# Altium schematic sheet OTHERS.SchDoc
size A4
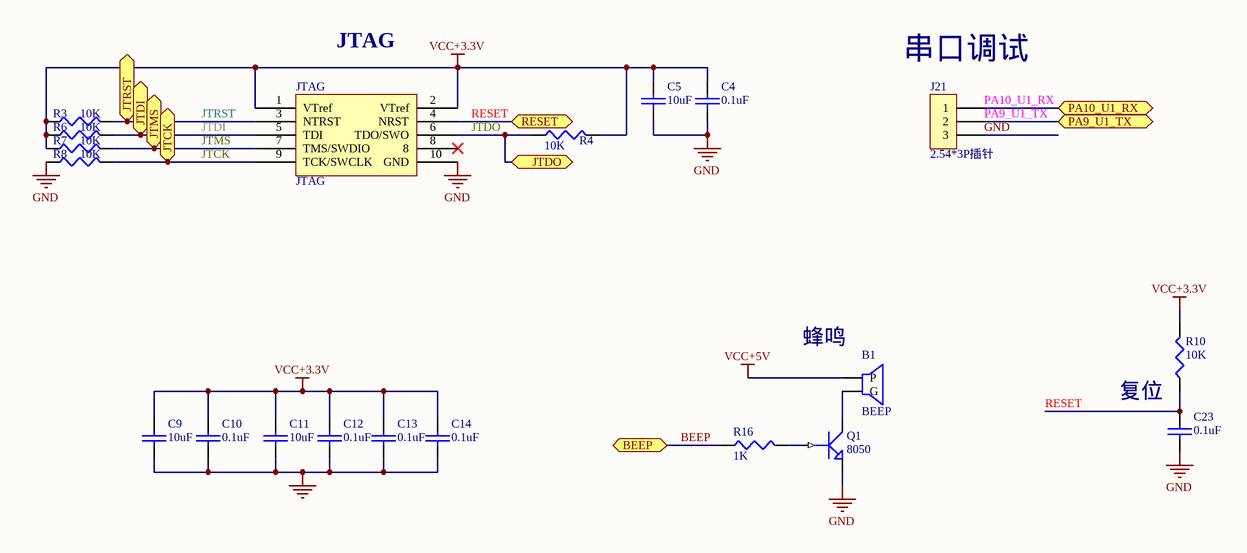
[diagram p0: OTHERS.SchDoc]

## Parts
B1  BEEP  [BEEP-W]
C4  0.1uF  [0603]
C5  10uF  [0805]
C9  10uF  [0805]
C10  0.1uF  [0603]
C11  10uF  [0805]
C12  0.1uF  [0603]
C13  0.1uF  [0603]
C14  0.1uF  [0603]
C23  0.1uF  [0603]
J21  2.54*3P插针  [2.54-TX]
JTAG  JTAG  [JTAG_10]
Q1  8050  [SOT-23]
R3  10K  [0603]
R4  10K  [0603]
R6  10K  [0603]
R7  10K  [0603]
R8  10K  [0603]
R10  10K  [0603]
R16  1K  [0603]

## Ports
BEEP, JTCK, JTDI, JTDO, JTMS, JTRST, PA9_U1_TX, PA10_U1_RX, RESET

## Nets
GND: C4.1 C5.2 C9.2 C10.1 C11.2 C12.1 C13.1 C14.1 C23.1 J21.3 JTAG.10(GND) Q1.2(E) R8.1
VCC+3.3V: C4.2 C5.1 C9.1 C10.2 C11.1 C12.2 C13.2 C14.2 JTAG.1(VTref) JTAG.2(VTref) R3.1 R4.2 R6.1 R7.1 R10.2
VCC+5V: B1.1(P)
BEEP: R16.1 ; port BEEP
JTCK: JTAG.9(TCK/SWCLK) R8.2 ; port JTCK
JTDI: JTAG.5(TDI) R6.2 ; port JTDI
JTDO: JTAG.6(TDO/SWO) R4.1 ; port JTDO
JTMS: JTAG.7(TMS/SWDIO) R7.2 ; port JTMS
JTRST: JTAG.3(NTRST) R3.2 ; port JTRST
PA9_U1_TX: J21.2 ; port PA9_U1_TX
PA10_U1_RX: J21.1 ; port PA10_U1_RX
RESET: C23.2 JTAG.4(NRST) R10.1 ; port RESET
NetB1_2: B1.2(G) Q1.3(C)
NetQ1_1: Q1.1(B) R16.2

Not connected (* = marked no-connect by the designer): JTAG 8*

## Notes on the sheet
- JTAG
- (near J21) 串口调试
- (near B1) 蜂鸣
- 复位

## Library data of the parts
B1 = BEEP: TMB12A05  5V有源电磁蜂鸣器
C4 C10 C12-C14 C23 = CAP-0603: 0603陶瓷贴片电容
C5 C9 C11 = CAP-0805: 0805陶瓷贴片电容
J21 = 2.54*3P插针: 2.54mm*3P单排插针
JTAG = JTAG: 2.54*5*2   2.54mm 5P双排排阵
Q1 = 8050: 8050 NPN型三极管
R3 R4 R6-R8 R10 R16 = RES-0603: 陶瓷贴片电阻0603封装